# Altium schematic sheet MCP73833.SchDoc
size A4
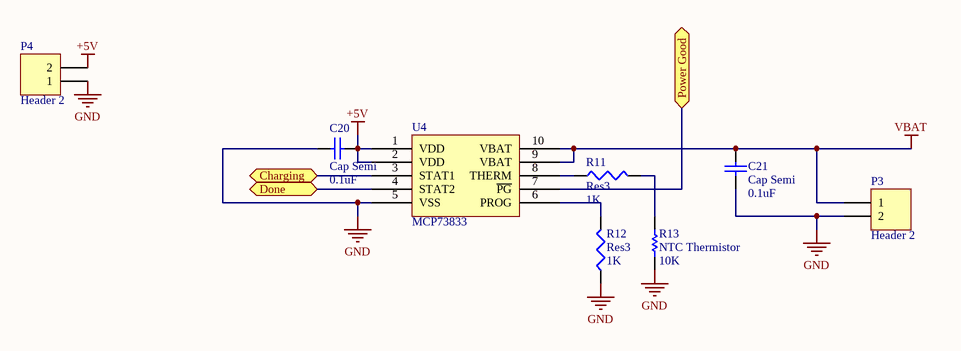
[diagram p0: MCP73833.SchDoc]

## Parts
C20  Cap Semi  value 0.1uF  [1608[0603]]
C21  Cap Semi  value 0.1uF  [1608[0603]]
P3  Header 2  [JST-PH-2]
P4  Header 2  [HDR1X2]
R11  Res3  value 1K  [J1-0603]
R12  Res3  value 1K  [J1-0603]
R13  NTC Thermistor  value 10K  [AXIAL-0.3]
U4  MCP73833  [TSSOP50P490X110-10N]

## Ports
Charging, Done, Power Good

## Nets
+5V: C20.1 P4.2 U4.1(VDD) U4.2(VDD)
GND: C20.2 C21.1 P3.2 P4.1 R12.1 R13.1 U4.5(VSS)
VBAT: C21.2 P3.1 U4.9(VBAT) U4.10(VBAT)
Charging: U4.3(STAT1) ; port Charging
Done: U4.4(STAT2) ; port Done
Power Good: U4.7(~{PG}) ; port Power Good
NetR11_1: R11.1 U4.8(THERM)
NetR11_2: R11.2 R13.2
NetR12_2: R12.2 U4.6(PROG)

## Library data of the parts
C20 C21 = Cap Semi: Capacitor (Semiconductor SIM Model); Published: 8-Jun-2000; LatestRevisionDate: 29-May-2009; LatestRevisionNote: IPC-7351 Footprint Added.; PackageReference: C1206; Publisher: Altium Limited; PackageDescription: Chip Capacitor
P3 P4 = Header 2: Header, 2-Pin; LatestRevisionDate: 17-Jul-2002; LatestRevisionNote: Re-released for DXP Platform.; Publisher: Altium Limited
R11 R12 = Res3: Resistor; Published: 8-Jun-2000; LatestRevisionDate: 29-May-2009; LatestRevisionNote: IPC-7351 Footprint Added.; PackageReference: J1-0603; Publisher: Altium Limited; PackageDescription: Chip Resistor
R13 = Res1: Resistor; Published: 8-Jun-2000; LatestRevisionDate: 17-Jul-2002; LatestRevisionNote: Re-released for DXP Platform.; PackageReference: AXIAL-0.3; Publisher: Altium Limited; PackageDescription: Axial Device, Thru-Hole; 2 Leads; 0.3 in Pin Spacing